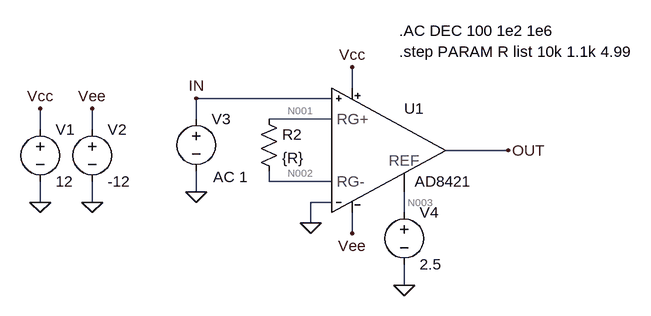
[diagram p0: schematic AD8421.asc]
AD8421.asc, the LTspice schematic file:
Version 4
SHEET 1 1148 680
WIRE 256 -32 256 -64
WIRE 224 -16 16 -16
WIRE 16 16 16 -16
WIRE 224 16 128 16
WIRE -224 32 -224 0
WIRE -144 32 -144 0
WIRE 496 64 400 64
WIRE 128 112 128 96
WIRE 224 112 128 112
WIRE 16 128 16 96
WIRE -224 144 -224 112
WIRE -144 144 -144 112
WIRE 224 144 192 144
WIRE 336 160 336 128
WIRE 192 176 192 144
WIRE 256 192 256 160
WIRE 336 272 336 240
FLAG -224 144 0
FLAG -144 144 0
FLAG -224 0 Vcc
FLAG -144 0 Vee
FLAG 16 128 0
FLAG 16 -16 IN
FLAG 496 64 OUT
FLAG 192 176 0
FLAG 256 -64 Vcc
FLAG 256 192 Vee
FLAG 336 272 0
SYMBOL voltage -224 16 R0
SYMATTR InstName V1
SYMATTR Value 12
SYMBOL voltage -144 16 R0
SYMATTR InstName V2
SYMATTR Value -12
SYMBOL res 112 0 R0
SYMATTR InstName R2
SYMATTR Value {R}
SYMBOL voltage 16 0 R0
WINDOW 123 26 105 Left 2
WINDOW 39 0 0 Left 2
SYMATTR Value2 AC 1
SYMATTR InstName V3
SYMATTR Value ""
SYMBOL AD8421 256 64 R0
SYMATTR InstName U1
SYMATTR SpiceModel LTC3.lib
SYMATTR Value2 LT1789-10
SYMATTR Description µPower, Single Supply Rail-to-Rail Output Instrumentation Amplifier
SYMBOL voltage 336 144 R0
SYMATTR InstName V4
SYMATTR Value 2.5
TEXT 328 -120 Left 2 !.AC DEC 100 1e2 1e6
TEXT 328 -88 Left 2 !.step PARAM R list 10k 1.1k 4.99

The netlist it stands for:
* AD8421.asc
V1 Vcc 0 12
V2 Vee 0 -12
R2 N001 N002 {R}
V3 IN 0 AC 1
XU1 IN N001 N002 0 N003 Vee OUT Vcc LT1789-10  ; pins IN- RG- RG+ IN+ -Vs REF Vout +Vs
V4 N003 0 2.5
.AC DEC 100 1e2 1e6
.step PARAM R list 10k 1.1k 4.99
.lib LTC3.lib
.backanno
.end

* Results of the author's LTspice run, read from the files saved beside the schematic
* Operating Point (first step), zero values left out:
*   r = 10 k
*   V(vcc) = 12 V
*   V(vee) = -12 V
*   V(n001) = -337.9 mV
*   V(n002) = -337.9 mV
*   V(out) = -673.7 mV
*   V(n003) = 2.5 V
*   I(V4) = -22.88 µA
*   I(V3) = -163.4 nA
*   I(V2) = 10.57 TA
*   I(V1) = -120.2 µA
*   Ix(u1:1) = 163.4 nA
*   Ix(u1:4) = 10.57 TA
*   Ix(u1:5) = 22.88 µA
*   Ix(u1:6) = -10.57 TA
*   Ix(u1:7) = 1.315 pA
*   Ix(u1:8) = 120.2 µA
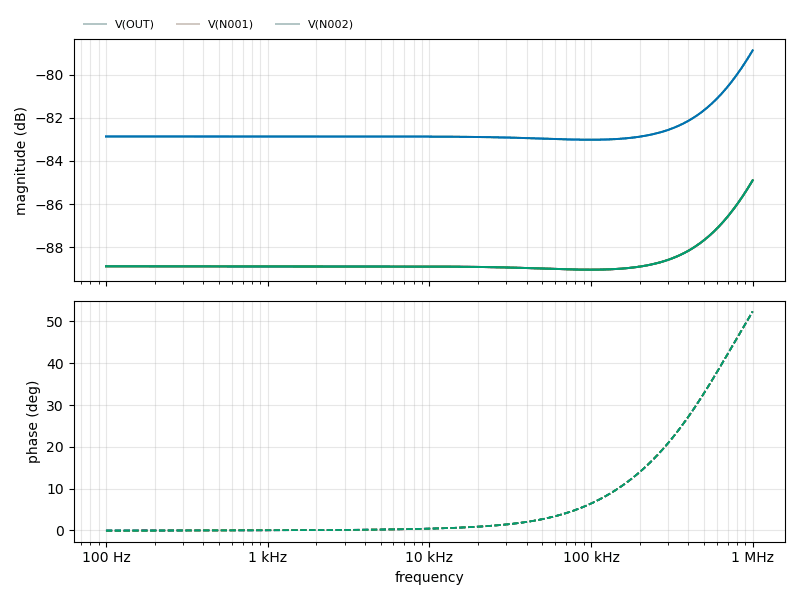
[diagram p1: AC Analysis of AD8421.asc, plotted from the saved traces]
* AC Analysis, 3 runs:
*   V(OUT) [r=10000]: -82.86 dB at 100 Hz, -78.88 dB at 1 MHz, peak -78.88 dB at 1 MHz, 3 dB below the peak at 453 kHz
*   V(OUT) [r=1100]: -82.86 dB at 100 Hz, -78.88 dB at 1 MHz, peak -78.88 dB at 1 MHz, 3 dB below the peak at 453 kHz
*   V(OUT) [r=4.99]: -82.86 dB at 100 Hz, -78.88 dB at 1 MHz, peak -78.88 dB at 1 MHz, 3 dB below the peak at 453 kHz
*   V(N001) [r=10000]: -88.88 dB at 100 Hz, -84.90 dB at 1 MHz, peak -84.90 dB at 1 MHz, 3 dB below the peak at 453 kHz
*   V(N001) [r=1100]: -88.88 dB at 100 Hz, -84.90 dB at 1 MHz, peak -84.90 dB at 1 MHz, 3 dB below the peak at 453 kHz
*   V(N001) [r=4.99]: -88.88 dB at 100 Hz, -84.90 dB at 1 MHz, peak -84.90 dB at 1 MHz, 3 dB below the peak at 453 kHz
*   V(N002) [r=10000]: -88.88 dB at 100 Hz, -84.90 dB at 1 MHz, peak -84.90 dB at 1 MHz, 3 dB below the peak at 453 kHz
*   V(N002) [r=1100]: -88.88 dB at 100 Hz, -84.90 dB at 1 MHz, peak -84.90 dB at 1 MHz, 3 dB below the peak at 453 kHz
*   V(N002) [r=4.99]: -88.88 dB at 100 Hz, -84.90 dB at 1 MHz, peak -84.90 dB at 1 MHz, 3 dB below the peak at 453 kHz